# EAGLE schematic power_monitor.sch (EAGLE 6.4)
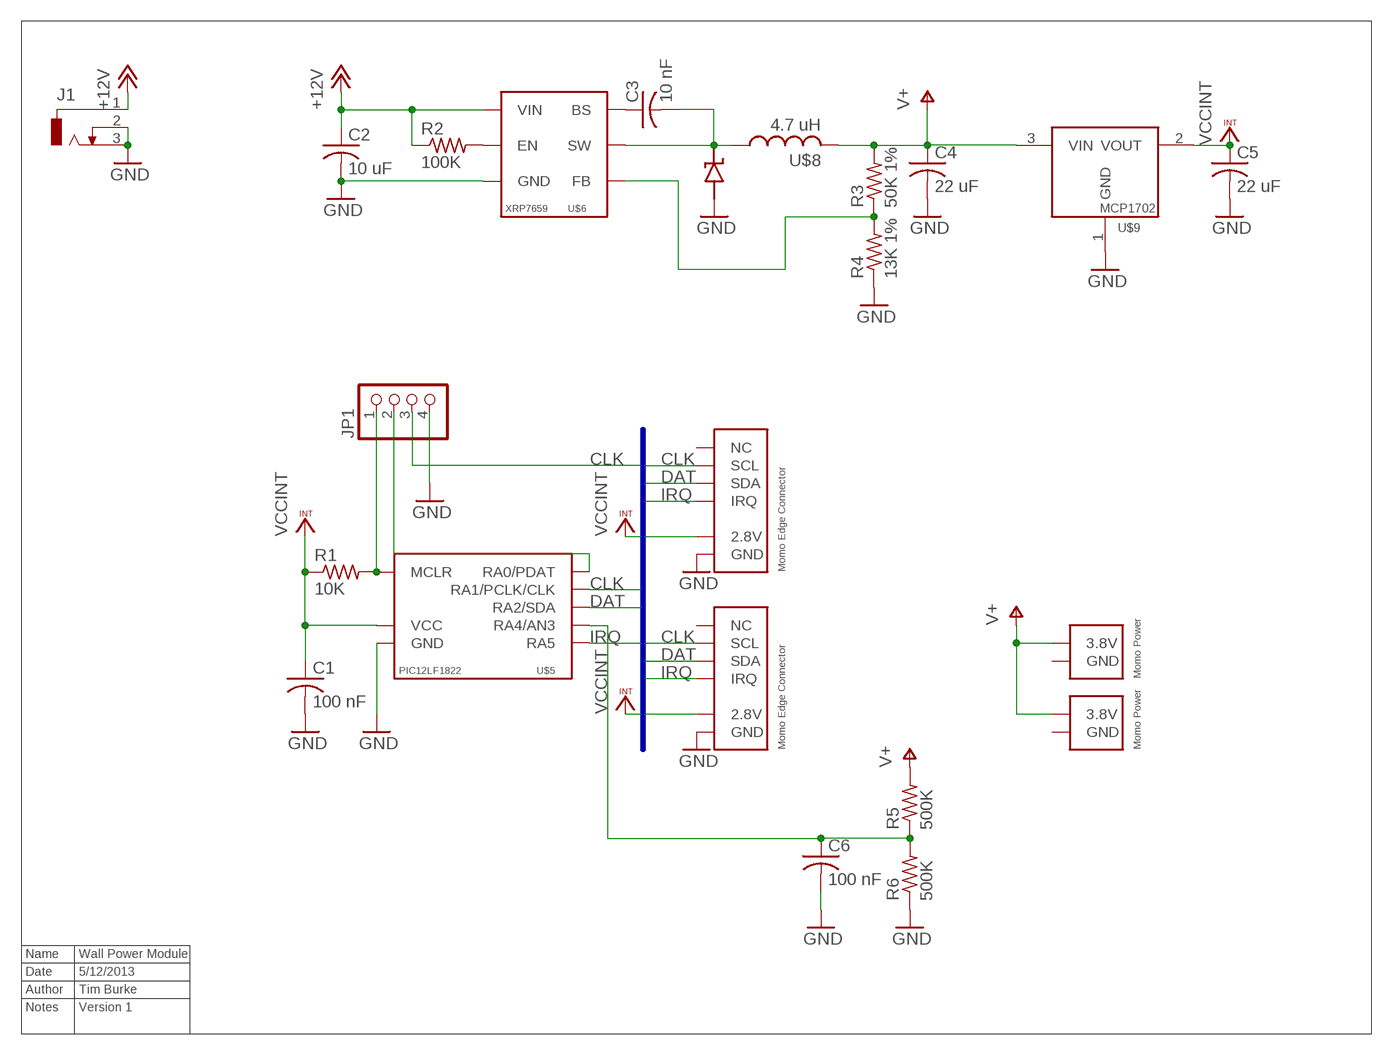
[diagram p0: schematic, sheet 1]

## Parts
C1  100 nF  C-USC0402  [C0402]
C2  10 uF  C-USC0805  [C0805]
C3  10 nF  C-USC0402  [C0402]
C4  22 uF  C-USC1206  [C1206]
C5  22 uF  C-USC0402  [C0402]
C6  100 nF  C-USC0402  [C0402]
J1  DCJ0303  [DCJ0303]
JP1  PINHD-1X4  [1X04]
R1  10K  R-US_R0603  [R0603]
R2  100K  R-US_R0603  [R0603]
R3  50K 1%  R-US_R0603  [R0603]
R4  13K 1%  R-US_R0603  [R0603]
R5  500K  R-US_R0603  [R0603]
R6  500K  R-US_R0603  [R0603]
U$1  MOMO-EDGE-SMALL-M  [MOMO-EDGE-SMALL-6M]
U$2  MOMO-EDGE-SMALL-F  [MOMO-EDGE-SMALL-6F]
U$3  MOMO-EDGE-POWER-M  [MOMO-EDGE-SMALL-2M]
U$4  MOMO-EDGE-POWER-F  [MOMO-EDGE-SMALL-2F]
U$5  PIC12LF1822  [SOIC8]
U$6  XRP7659  [SOT23-6L]
U$7  DIODE_SS2P3  [DIODE_SS2P3]
U$8  4.7 uH  NR6028-INDUCTOR  [NR6028-INDUCTOR]
U$9  MCP1702  [SOT23]

## Nets
+12V: C2.1 J1.1 R2.1 U$6.5(VIN)
CLK: JP1.3 U$1.3(SCL) U$2.3(SCL) U$5.6(RA1/PCLK/CLK)
DAT: U$1.4(SDA) U$2.4(SDA) U$5.5(RA2/SDA)
GND: C1.2 C2.2 C4.2 C5.2 C6.2 J1.2 J1.3 JP1.4 R4.1 R6.1 U$1.6(GND) U$2.6(GND) U$5.8(GND) U$6.2(GND) U$7.AN U$9.1(GND)
IRQ: U$1.5(IRQ) U$2.5(IRQ) U$5.2(RA5)
N$1: JP1.1 R1.2 U$5.4(MCLR)
N$2: C3.2 U$6.6(SW) U$7.CATH U$8.1
N$3: R2.2 U$6.4(EN)
N$4: C3.1 U$6.1(BS)
N$5: C6.1 R5.1 R6.2 U$5.3(RA4/AN3)
N$6: R3.1 R4.2 U$6.3(FB)
N$8: JP1.2 U$5.7(RA0/PDAT)
V+: C4.1 R3.2 R5.2 U$3.1(3.8V) U$4.1(3.8V) U$8.2 U$9.3(VIN)
VCCINT: C1.1 C5.1 R1.1 U$1.1(2.8V) U$2.1(2.8V) U$5.1(VCC) U$9.2(VOUT)

## Buses
PICBUS:CLK,DAT,IRQ

## Notes on the sheet
- Name | Wall Power Module
- Date | 5/12/2013
- Author | Tim Burke
- Notes | Version 1

## Power pins joined to a net without a drawn wire
GND: U$3.2(GND) U$4.2(GND)
NC: U$1.2(NC) U$2.2(NC)

## Library data of the parts
C1-C6 = rcl:C-US: CAPACITOR, American symbol
J1 = con-jack:DCJ0303: DC POWER JACK Source: DCJ0303.pdf; OC_FARNELL: unknown; OC_NEWARK: unknown
JP1 = pinhead:PINHD-1X4: PIN HEADER
R1-R6 = rcl:R-US_: RESISTOR, American symbol
U$1 = components:MOMO-EDGE-SMALL-M
U$2 = components:MOMO-EDGE-SMALL-F
U$3 = components:MOMO-EDGE-POWER-M
U$4 = components:MOMO-EDGE-POWER-F: MoMo two pin edge connector for high power passthrough - Female
U$5 = components:PIC12LF1822
U$6 = components:XRP7659
U$7 = components:DIODE_SS2P3
U$8 = components:NR6028-INDUCTOR
U$9 = components:MCP1702